# EAGLE design shinobi_solar (EAGLE 8.2.2)
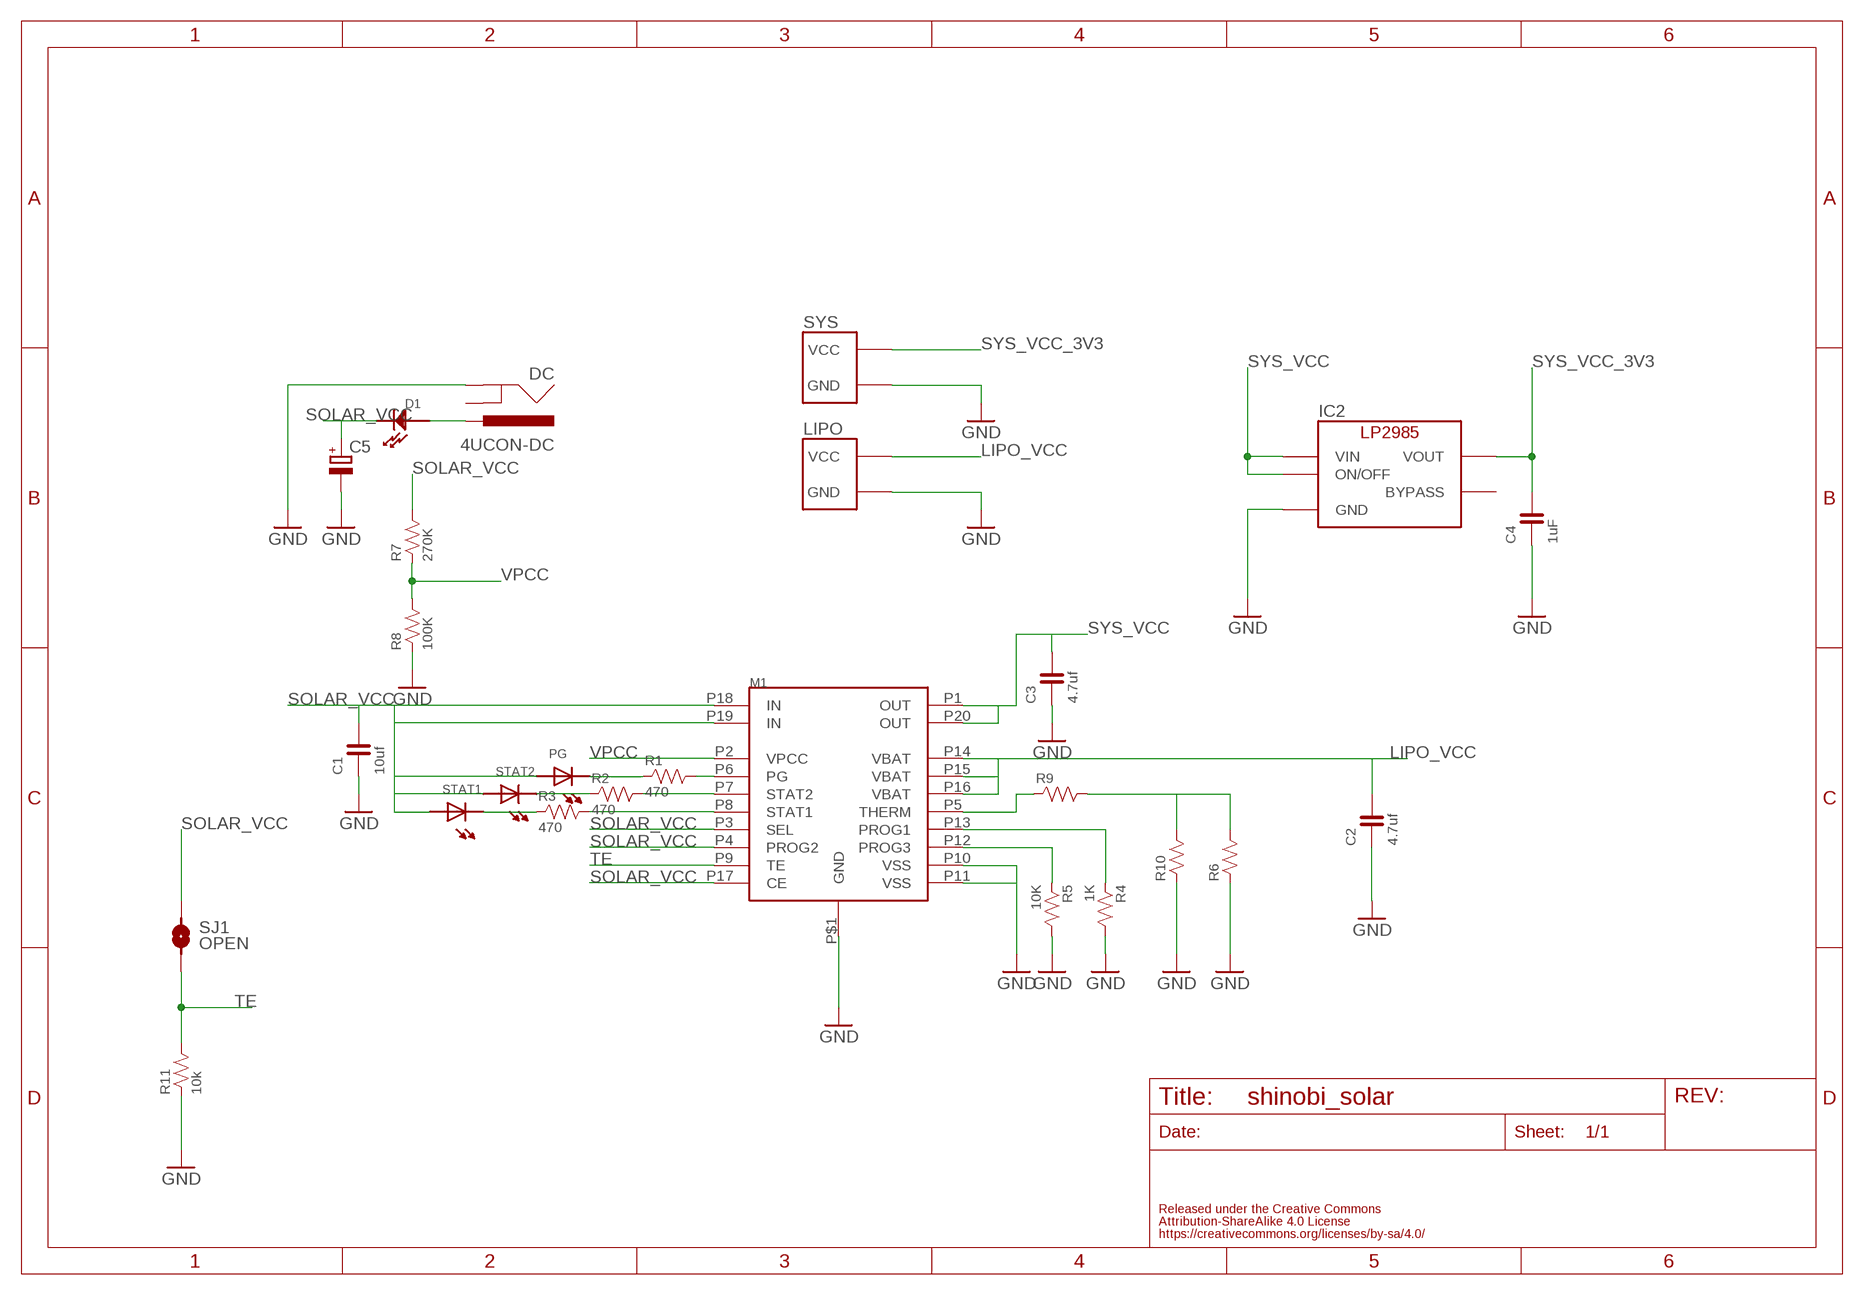
[diagram p0: schematic, sheet 1]

## Parts
C1  10uf  CAPACITOR-0603  [0603]
C2  4.7uf  CAPACITOR-0603  [0603]
C3  4.7uf  CAPACITOR-0603  [0603]
C4  1uF  CAPACITOR-0603  [0603]
C5  CPOL-EUE5-13  [E5-13]
D1  DIODEDO-214AC  [DO-214AC]
DC  4UCON-DC  [4UCON-DC]
IC2  LP2985-33DBV  [SOT-23-5]
LIPO  FABO_BRICK_2PIN_SIDE  [FABO_BRICK_2PIN_S02B−PASK-2_SILK]
M1  MCP73871  [QFN]
PG  LED-0603  [0603]
R1  470  RESISTOR-0603  [0603]
R2  470  RESISTOR-0603  [0603]
R3  470  RESISTOR-0603  [0603]
R4  1K  RESISTOR-0603  [0603]
R5  10K  RESISTOR-0603  [0603]
R6  RESISTOR-0603  [0603]
R7  270K  RESISTOR-0603  [0603]
R8  100K  RESISTOR-0603  [0603]
R9  RESISTOR-0603  [0603]
R10  RESISTOR-AXL-REGULAR  [AXL-REGULAR]
R11  10k  RESISTOR-0603  [0603]
SJ1  OPEN  SMD-JUMPER-2  [SMD-JUMPER-2]
STAT1  LED-0603  [0603]
STAT2  LED-0603  [0603]
SYS  FABO_BRICK_2PIN_SIDE  [FABO_BRICK_2PIN_S02B−PASK-2_SILK]

## Nets
GND: C1.1 C2.1 C3.1 C4.1 C5.- DC.GND1(GND) IC2.2(GND) LIPO.GND M1.P10(VSS) M1.P11(VSS) M1.P$1(GND) R4.2 R5.2 R6.1 R8.1 R10.1 R11.1 SYS.GND
LIPO_VCC: C2.2 LIPO.VCC M1.P14(VBAT) M1.P15(VBAT) M1.P16(VBAT)
N$1: PG.CATHODE R1.1
N$2: R2.1 STAT2.CATHODE
N$3: M1.P5(THERM) R9.1
N$4: M1.P12(PROG3) R5.1
N$5: R6.2 R9.2 R10.2
N$6: M1.P13(PROG1) R4.1
N$8: R3.1 STAT1.CATHODE
N$10: D1.CATHODE DC.VCC(PWR)
N$11: M1.P6(PG) R1.2
N$12: M1.P7(STAT2) R2.2
N$13: M1.P8(STAT1) R3.2
SOLAR_VCC: C1.2 C5.+ D1.ANODE M1.P3(SEL) M1.P4(PROG2) M1.P17(CE) M1.P18(IN) M1.P19(IN) PG.ANODE R7.2 SJ1.1 STAT1.ANODE STAT2.ANODE
SYS_VCC: C3.2 IC2.1(VIN) IC2.3(ON/OFF) M1.P1(OUT) M1.P20(OUT)
SYS_VCC_3V3: C4.2 IC2.5(VOUT) SYS.VCC
TE: M1.P9(TE) R11.2 SJ1.2
VPCC: M1.P2(VPCC) R7.1 R8.2
Unconnected: DC.GND2(GNDBREAK) IC2.4(BYPASS)

## Library data of the parts
C1-C4 = FaBo-Capacitor:CAPACITOR: CAPACITOR
C5 = rcl:CPOL-EU: POLARIZED CAPACITOR, European symbol
D1 = FaBo-Diode:DIODE
DC = FaBo-Supply:4UCON-DC
IC2 = FaBo-Supply:LP2985: LP2985
LIPO SYS = FaBo-Template:FABO_BRICK_2PIN
M1 = FaBo-Solar:MCP73871
PG STAT1 STAT2 = FaBo-LED:LED
R1-R11 = FaBo-Resistors:RESISTOR: RESISTOR
SJ1 = FaBo-etc:SMD-JUMPER-2

## Board
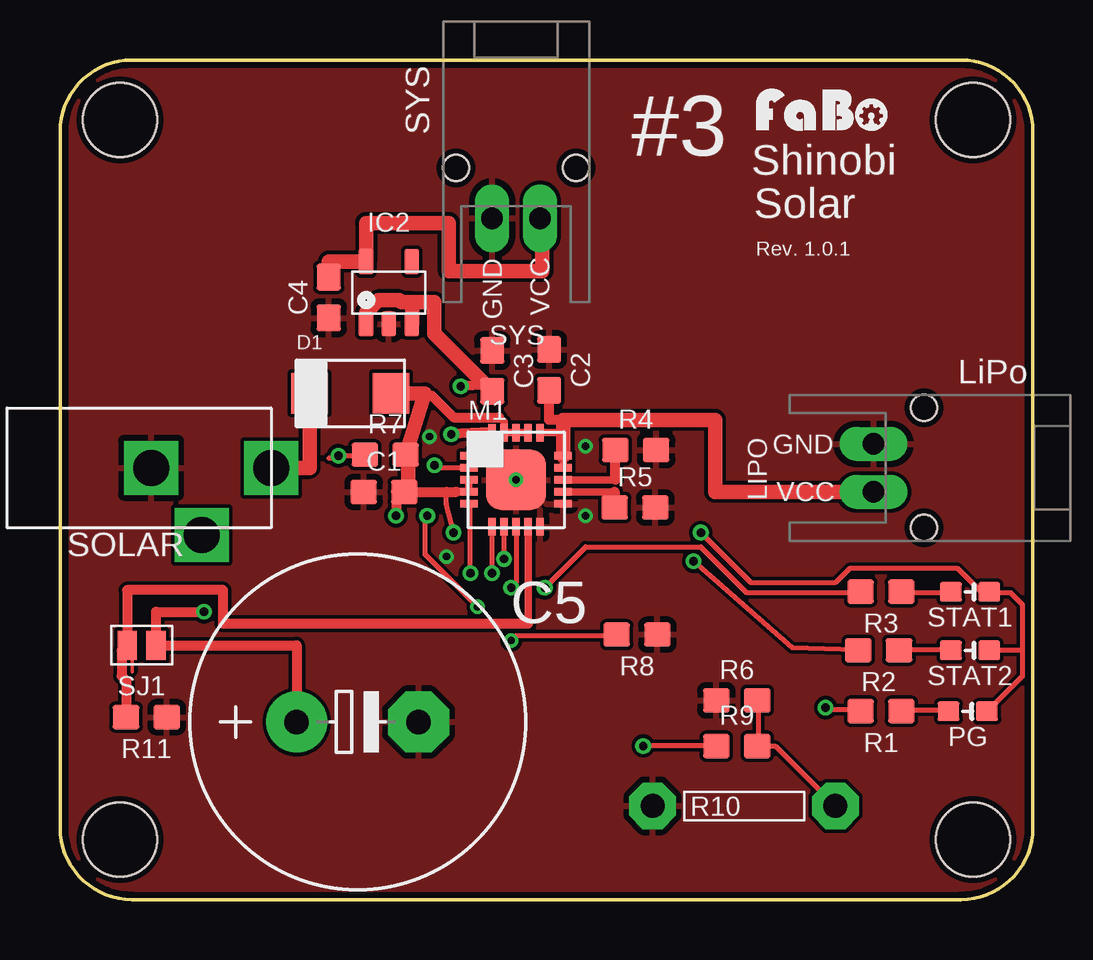
[diagram p1: board, top side]
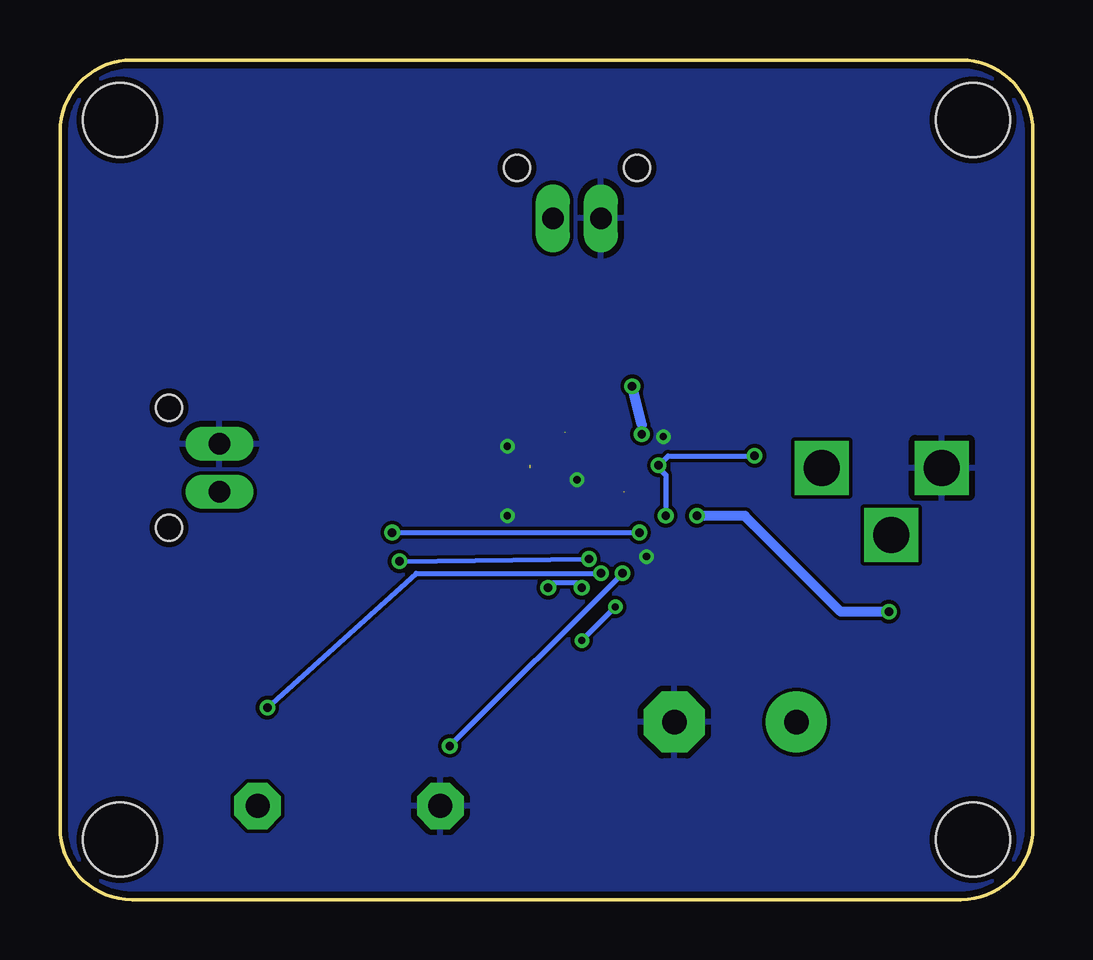
[diagram p2: board, bottom side, seen from below]

Size 40.54 x 35 mm. Coordinates in mm from the lower left corner, seen from the top.
Copper layers (1*16): Top 0.035mm / dielectric 1.5mm / Bottom 0.035mm
Design rules "SeeedStudio_2layer_DRU_no_angle_20140221": minimum track width 6mil, minimum drill 12mil, track to track 6mil, track to pad 6mil, pad to pad 6mil, via to via 6mil, smd to smd 0mil, copper to edge 10mil, drill to drill 10mil, minimum pad ring 10mil, minimum via ring 6mil, stop-mask expansion 2mil, vias tented up to drill 100mil, thermal gap 10mil

### Footprints (pad centres in the part's own frame; a part is rotated, then mirrored left to right if it is on the bottom)
0603 = smd 1.1 x 1: 1 -0.85,0; 2 0.85,0
E5-13 = drill 1.016 pad 2.54: + -2.54,0 | drill 1.016 pad 2.54 octagon: - 2.54,0
DO-214AC = smd 1.52 x 1.68: ANODE 1.7,0; CATHODE -1.7,0
4UCON-DC = drill 1.5 square: GND1 0.5,0; GND2 2.6,-2.8; VCC 5.5,0
SOT-23-5 = smd 0.6 x 1.05: 1 -0.95,-1.3; 2 0,-1.3; 3 0.95,-1.3; 4 0.95,1.3; 5 -0.95,1.3
FABO_BRICK_2PIN_S02B−PASK-2_SILK = drill 0.9 pad 1.422 long: GND -1,-0.102; VCC 1,-0.102 | hole 1.1: 2.5,1.998; -2.5,1.998
QFN = smd 0.73 x 0.3: P1 -1.965,1; P2 -1.965,0.5; P3 -1.965,0; P4 -1.965,-0.5; P5 -1.965,-1; P11 1.965,-1; P12 1.965,-0.5; P13 1.965,0; P14 1.965,0.5; P15 1.965,1 | smd 0.3 x 0.73: P6 -1,-1.965; P7 -0.5,-1.965; P8 0,-1.965; P9 0.5,-1.965; P10 1,-1.965; P16 1,1.965; P17 0.5,1.965; P18 0,1.965; P19 -0.5,1.965; P20 -1,1.965 | smd 2.5 x 2.5: P$1 0,0
0603' = smd 0.9 x 0.8: ANODE -0.8,0; CATHODE 0.8,0
AXL-REGULAR = drill 1 pad 1.93 octagon: 1 -3.81,0; 2 3.81,0
SMD-JUMPER-2 = smd 0.8 x 1.2: 1 -0.6,0; 2 0.6,0
FABO-SHINOBI = hole 3.1: 2.5,32.5; 38.04,32.5; 38.04,2.5; 2.5,2.5

### Placement (x,y rotation side)
C1  13.5,16.99 0 top
C2  20.38,22.08 270 top
C3  18.01,22.04 270 top
C4  11.2,25.1 90 top
C5  12.4,7.4 0 top
D1  12.1,21.1 0 top
DC  3.3,18 0 top
IC2  13.7,25.3 0 top
LIPO  34,18 270 top
M1  19,17.5 0 top
PG  [0603']  37.82,7.85 180 top
R1  34.21,7.85 180 top
R2  34.11,10.39 180 top
R3  34.21,12.83 180 top
R4  23.99,18.74 0 top
R5  23.96,16.34 0 top
R6  28.2,8.3 0 top
R7  13.55,18.55 0 top
R8  24.04,11.05 180 top
R9  28.2,6.4 0 top
R10  28.5,3.9 0 top
R11  3.6,7.6 180 top
SJ1  3.4,10.6 180 top
STAT1  [0603']  37.92,12.83 180 top
STAT2  [0603']  37.92,10.39 180 top
SYS  19,28.5 0 top
U$1  [LOGO_FABO_S]  31.8,31.9 0 top
U$2  [FABO-SHINOBI]  0,0 0 top

### Tracks (layer width: path | path; a pad name or v marks a point on that pad's centre or on a via)
GND  (via drill 0.3)
  other vias: 19,17.5 21.9,16 15.4,19.3 21.9,18.9 16.1,14.3
  pour Bottom: 0,0 41,0 41,35 0,35
  pour Top: 0,0 41,0 41,35 0,35
LIPO_VCC  (1 unrouted)
  Top 0.305: 20.96,18.11 M1.P15 | M1.P16 20.96,19.46
  Top 0.406: 20.96,20 20.38,20 C2.2
  Top 0.61: LIPO.VCC 27.3,17 27.3,20 20.96,20 20.96,19.46 M1.P15
N$1
  Top 0.203: PG.CATHODE 37,7.9 35.1,7.9 R1.1
N$2
  Top 0.203: R2.1 35,10.4 37.1,10.4 STAT2.CATHODE
N$3  (via drill 0.35)
  Top 0.203: v17.1,13.6 17.1,16.5 M1.P5 | R9.1 v24.3,6.4
  Bottom 0.203: v24.3,6.4 v17.1,13.6
N$4
  Top 0.305: M1.P12 23.11,17
  Top 0.406: 23.11,17 R5.1
N$5
  Top 0.203: R6.2 29.1,8.3 29.1,6.4 R9.2 29.8,6.4 R10.2
N$6
  Top 0.305: M1.P13 23.14,17.5
  Top 0.406: 23.14,17.5 R4.1
N$7
  Top 0.152: 3,10 3,9.5
N$8
  Top 0.203: STAT1.CATHODE 37.1,12.8 35.1,12.8 R3.1
N$10
  Top 0.61: DC.VCC 10.4,18 D1.CATHODE
N$11  (via drill 0.35)
  Top 0.203: v18,13.6 M1.P6 | v31.9,8 32,7.9 33.3,7.9 R1.2
  Bottom 0.203: v18,13.6 25.7,13.6 v31.9,8
N$12  (via drill 0.35)
  Top 0.203: v18.5,14.2 M1.P7 | v26.4,14.1 30.5,10.5 33.2,10.4 R2.2
  Bottom 0.203: v26.4,14.1 v18.5,14.2
N$13  (via drill 0.35)
  Top 0.203: v20.2,13 21.9,14.7 26.7,14.7 28.6,12.8 33.3,12.8 R3.2 | v18.8,13 19,13.2 M1.P8
  Bottom 0.203: v20.2,13 20,13.2 19,13.2 v18.8,13
SOLAR_VCC  (via drill 0.35)  (2 unrouted)
  Top 0.203: 40.1,10.4 40.1,12.3 39.6,12.8 38.8,12.8 STAT1.ANODE 38.7,12.8 38.4,12.8 37.4,13.8 32.9,13.8 32.3,13.2 28.8,13.2 v26.7,15.3 | 40.1,10.4 40.1,9.3 38.7,7.9 PG.ANODE | 16.1,16.99 16.1,16.5 v16.4,15.3 | 40.1,10.4 38.8,10.4 STAT2.ANODE | 15.5,21 15.2,21.1 | 14,17 C1.2
  Top 0.305: 17.02,17.01 16.52,17.01 | 17.02,17.01 17.04,17.31 | M1.P3 17.02,17.5 17.02,17.01 | M1.P17 M1.P18 M1.P19 18.5,19.9 18.3,20.1
  Top 0.406: C1.2 16.1,16.99 16.51,16.99 16.52,17.01 | C5.+ 9.86,10.6 SJ1.1 4,12 v6,12 | 18.3,20.1 16.4,20.1 15.5,21 | 14,17 v14,16
  Top 0.61: D1.ANODE 15.2,21.1 R7.2 14.5,18.3 14.5,17.1 C1.2
  Bottom 0.203: v26.7,15.3 v16.4,15.3
  Bottom 0.406: v14,16 12,16 8,12 v6,12
SYS_VCC  (via drill 0.35)
  Top 0.203: 17.2,18.7 M1.P1 | 17.8,19.3 M1.P20 17.9,19.5
  Top 0.406: 17.8,19.3 17.2,18.7 | v16.7,21.4 17.7,21.5 | 17.9,19.5 v16.3,19.4
  Top 0.61: C3.2 17.7,21.5 15.6,23.6 15.6,24.9 14.67,24.9 | 14.67,24.9 14.22,24.9 14.14,24.98 13.26,24.98 12.75,24.47 IC2.1 | IC2.3 14.67,24 14.67,24.9
  Bottom 0.203: v16.3,19.4 16.3,19.8
  Bottom 0.406: 16.3,19.8 v16.7,21.4
SYS_VCC_3V3
  Top 0.61: SYS.VCC 20.1,28.4 20.1,26.2 16.2,26.2 16.2,28.2 12.75,28.2 IC2.5 11.2,26.6 C4.2
TE
  Top 0.305: M1.P9 19.5,11.5
  Top 0.406: 19.5,11.5 6.8,11.5 6.8,12.9 2.8,12.9 SJ1.2 2.57,10.37 2.57,9.32 2.75,9.14 R11.2
VPCC  (via drill 0.3, 0.35)
  Top 0.203: v15.6,18.1 15.7,18 M1.P2 | 11.2,18.4 11.3,18.4 11.4,18.5 v11.6,18.5 12.7,18.5 R7.1 | v17.4,12.2 15.2,14.4 15.2,15.9 v15.3,16 | v18.8,10.8 19,11 23.1,11 R8.2
  Bottom 0.203: v11.6,18.5 15.2,18.5 v15.6,18.1 15.6,18 15.3,17.7 v15.3,16 | v18.8,10.8 v17.4,12.2

### Text on the board
tPlace: SYS | #3 | Shinobi | Solar | Rev. 1.0.1 | LiPo | SOLAR